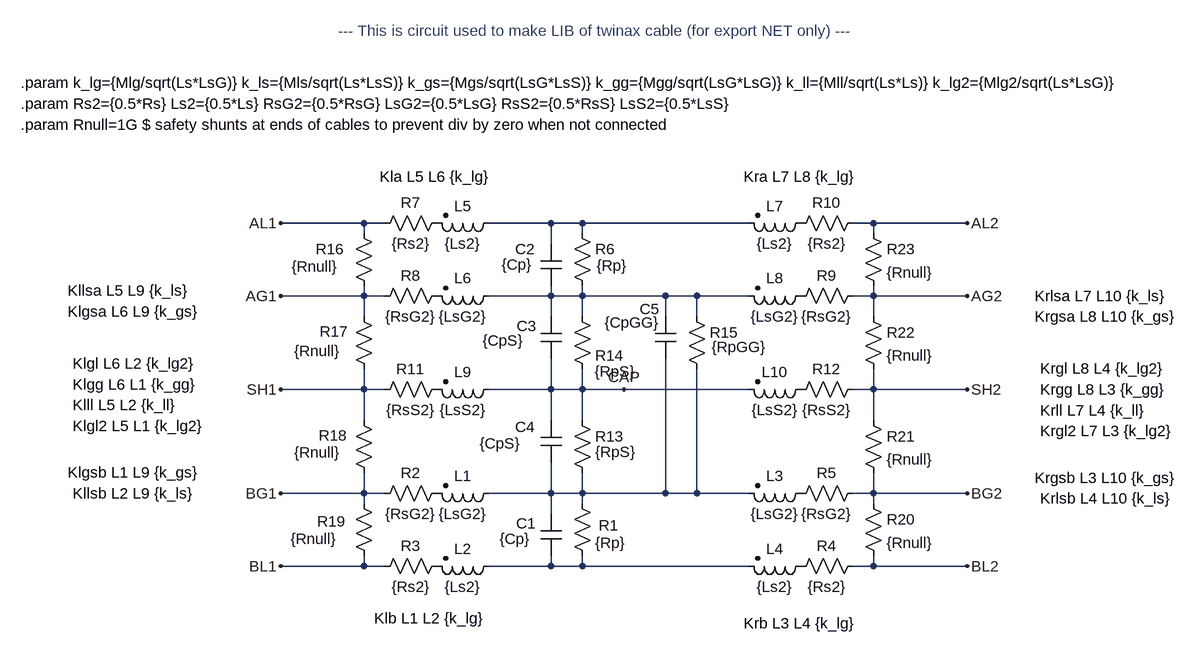
[diagram p0: schematic twax_model_temp.asc]
twax_model_temp.asc, the LTspice schematic file:
Version 4
SHEET 1 1768 680
WIRE -144 -336 -272 -336
WIRE -112 -336 -144 -336
WIRE 144 -336 48 -336
WIRE 192 -336 144 -336
WIRE 448 -336 192 -336
WIRE 640 -336 608 -336
WIRE 784 -336 640 -336
WIRE -144 -320 -144 -336
WIRE 192 -320 192 -336
WIRE 640 -320 640 -336
WIRE 144 -304 144 -336
WIRE -144 -224 -144 -240
WIRE -144 -224 -272 -224
WIRE -112 -224 -144 -224
WIRE 144 -224 144 -240
WIRE 144 -224 48 -224
WIRE 192 -224 192 -240
WIRE 192 -224 144 -224
WIRE 320 -224 192 -224
WIRE 368 -224 320 -224
WIRE 448 -224 368 -224
WIRE 640 -224 640 -240
WIRE 640 -224 608 -224
WIRE 784 -224 640 -224
WIRE -144 -192 -144 -224
WIRE 144 -192 144 -224
WIRE 192 -192 192 -224
WIRE 320 -192 320 -224
WIRE 368 -192 368 -224
WIRE 640 -192 640 -224
WIRE -144 -80 -144 -112
WIRE -144 -80 -272 -80
WIRE -112 -80 -144 -80
WIRE 144 -80 144 -128
WIRE 144 -80 48 -80
WIRE 192 -80 192 -112
WIRE 192 -80 144 -80
WIRE 256 -80 192 -80
WIRE 448 -80 256 -80
WIRE 640 -80 640 -112
WIRE 640 -80 608 -80
WIRE 784 -80 640 -80
WIRE -144 -32 -144 -80
WIRE 144 -32 144 -80
WIRE 192 -32 192 -80
WIRE 640 -32 640 -80
WIRE -144 80 -144 48
WIRE -144 80 -272 80
WIRE -112 80 -144 80
WIRE 144 80 144 32
WIRE 144 80 48 80
WIRE 192 80 192 48
WIRE 192 80 144 80
WIRE 320 80 320 -128
WIRE 320 80 192 80
WIRE 368 80 368 -112
WIRE 368 80 320 80
WIRE 448 80 368 80
WIRE 640 80 640 48
WIRE 640 80 608 80
WIRE 784 80 640 80
WIRE -144 96 -144 80
WIRE 192 96 192 80
WIRE 640 96 640 80
WIRE 144 112 144 80
WIRE -144 192 -144 176
WIRE -144 192 -272 192
WIRE -112 192 -144 192
WIRE 144 192 144 176
WIRE 144 192 48 192
WIRE 192 192 192 176
WIRE 192 192 144 192
WIRE 448 192 192 192
WIRE 640 192 640 176
WIRE 640 192 608 192
WIRE 784 192 640 192
FLAG -272 -336 AL1
FLAG -272 -224 AG1
FLAG 784 -336 AL2
FLAG 784 -224 AG2
FLAG 784 80 BG2
FLAG 784 192 BL2
FLAG -272 80 BG1
FLAG -272 192 BL1
FLAG -272 -80 SH1
FLAG 784 -80 SH2
FLAG 256 -80 CAP
SYMBOL ind2 64 64 R90
WINDOW 0 5 56 VBottom 2
WINDOW 3 32 56 VTop 2
SYMATTR InstName L1
SYMATTR Value {LsG2}
SYMATTR Type ind
SYMBOL ind2 64 176 R90
WINDOW 0 5 56 VBottom 2
WINDOW 3 32 56 VTop 2
SYMATTR InstName L2
SYMATTR Value {Ls2}
SYMATTR Type ind
SYMBOL ind2 544 64 R90
WINDOW 0 5 56 VBottom 2
WINDOW 3 32 56 VTop 2
SYMATTR InstName L3
SYMATTR Value {LsG2}
SYMATTR Type ind
SYMBOL ind2 544 176 R90
WINDOW 0 5 56 VBottom 2
WINDOW 3 32 56 VTop 2
SYMATTR InstName L4
SYMATTR Value {Ls2}
SYMATTR Type ind
SYMBOL cap 128 112 R0
WINDOW 0 -38 14 Left 2
WINDOW 3 -63 38 Left 2
SYMATTR InstName C1
SYMATTR Value {Cp}
SYMBOL res 176 80 R0
WINDOW 0 41 49 Left 2
SYMATTR InstName R1
SYMATTR Value {Rp}
SYMBOL res -16 64 R90
WINDOW 0 0 56 VBottom 2
WINDOW 3 32 56 VTop 2
SYMATTR InstName R2
SYMATTR Value {RsG2}
SYMBOL res -16 176 R90
WINDOW 0 0 56 VBottom 2
WINDOW 3 32 56 VTop 2
SYMATTR InstName R3
SYMATTR Value {Rs2}
SYMBOL res 624 176 R90
WINDOW 0 0 56 VBottom 2
WINDOW 3 32 56 VTop 2
SYMATTR InstName R4
SYMATTR Value {Rs2}
SYMBOL res 624 64 R90
WINDOW 0 0 56 VBottom 2
WINDOW 3 32 56 VTop 2
SYMATTR InstName R5
SYMATTR Value {RsG2}
SYMBOL ind2 64 -352 R90
WINDOW 0 5 56 VBottom 2
WINDOW 3 32 56 VTop 2
SYMATTR InstName L5
SYMATTR Value {Ls2}
SYMATTR Type ind
SYMBOL ind2 64 -240 R90
WINDOW 0 4 56 VBottom 2
WINDOW 3 32 56 VTop 2
SYMATTR InstName L6
SYMATTR Value {LsG2}
SYMATTR Type ind
SYMBOL ind2 544 -352 R90
WINDOW 0 5 56 VBottom 2
WINDOW 3 32 56 VTop 2
SYMATTR InstName L7
SYMATTR Value {Ls2}
SYMATTR Type ind
SYMBOL ind2 544 -240 R90
WINDOW 0 4 56 VBottom 2
WINDOW 3 32 56 VTop 2
SYMATTR InstName L8
SYMATTR Value {LsG2}
SYMATTR Type ind
SYMBOL cap 128 -304 R0
WINDOW 0 -39 8 Left 2
WINDOW 3 -60 32 Left 2
SYMATTR InstName C2
SYMATTR Value {Cp}
SYMBOL res 176 -336 R0
WINDOW 3 38 65 Left 2
SYMATTR Value {Rp}
SYMATTR InstName R6
SYMBOL res -16 -352 R90
WINDOW 0 0 56 VBottom 2
WINDOW 3 32 56 VTop 2
SYMATTR InstName R7
SYMATTR Value {Rs2}
SYMBOL res -16 -240 R90
WINDOW 0 0 56 VBottom 2
WINDOW 3 32 56 VTop 2
SYMATTR InstName R8
SYMATTR Value {RsG2}
SYMBOL res 624 -240 R90
WINDOW 0 0 56 VBottom 2
WINDOW 3 32 56 VTop 2
SYMATTR InstName R9
SYMATTR Value {RsG2}
SYMBOL res 624 -352 R90
WINDOW 0 0 56 VBottom 2
WINDOW 3 32 56 VTop 2
SYMATTR InstName R10
SYMATTR Value {Rs2}
SYMBOL ind2 64 -96 R90
WINDOW 0 5 56 VBottom 2
WINDOW 3 32 56 VTop 2
SYMATTR InstName L9
SYMATTR Value {LsS2}
SYMATTR Type ind
SYMBOL ind2 544 -96 R90
WINDOW 0 5 56 VBottom 2
WINDOW 3 32 56 VTop 2
SYMATTR InstName L10
SYMATTR Value {LsS2}
SYMATTR Type ind
SYMBOL res -16 -96 R90
WINDOW 0 0 56 VBottom 2
WINDOW 3 32 56 VTop 2
SYMATTR InstName R11
SYMATTR Value {RsS2}
SYMBOL res 624 -96 R90
WINDOW 0 0 56 VBottom 2
WINDOW 3 32 56 VTop 2
SYMATTR InstName R12
SYMATTR Value {RsS2}
SYMBOL cap 128 -192 R0
WINDOW 0 -37 14 Left 2
WINDOW 3 -89 37 Left 2
SYMATTR InstName C3
SYMATTR Value {CpS}
SYMBOL cap 128 -32 R0
WINDOW 0 -39 10 Left 2
WINDOW 3 -94 35 Left 2
SYMATTR InstName C4
SYMATTR Value {CpS}
SYMBOL res 176 -48 R0
WINDOW 3 36 64 Left 2
SYMATTR Value {RpS}
SYMATTR InstName R13
SYMBOL res 176 -208 R0
WINDOW 0 36 76 Left 2
WINDOW 3 35 100 Left 2
SYMATTR InstName R14
SYMATTR Value {RpS}
SYMBOL cap 304 -192 R0
WINDOW 0 -24 -12 Left 2
WINDOW 3 -78 9 Left 2
SYMATTR InstName C5
SYMATTR Value {CpGG}
SYMBOL res 352 -208 R0
WINDOW 3 39 63 Left 2
SYMATTR Value {RpGG}
SYMATTR InstName R15
SYMBOL res -160 -336 R0
WINDOW 0 -58 40 Left 2
WINDOW 3 -95 67 Left 2
SYMATTR InstName R16
SYMATTR Value {Rnull}
SYMBOL res -160 -208 R0
WINDOW 0 -52 39 Left 2
WINDOW 3 -91 69 Left 2
SYMATTR InstName R17
SYMATTR Value {Rnull}
SYMBOL res -160 -48 R0
WINDOW 0 -54 39 Left 2
WINDOW 3 -91 65 Left 2
SYMATTR InstName R18
SYMATTR Value {Rnull}
SYMBOL res -160 80 R0
WINDOW 0 -56 43 Left 2
WINDOW 3 -97 70 Left 2
SYMATTR InstName R19
SYMATTR Value {Rnull}
SYMBOL res 624 80 R0
SYMATTR InstName R20
SYMATTR Value {Rnull}
SYMBOL res 624 -48 R0
SYMATTR InstName R21
SYMATTR Value {Rnull}
SYMBOL res 624 -208 R0
SYMATTR InstName R22
SYMATTR Value {Rnull}
SYMBOL res 624 -336 R0
SYMATTR InstName R23
SYMATTR Value {Rnull}
TEXT -184 -632 Left 2 ;--- This is circuit used to make LIB of twinax cable (for export NET only) ---
TEXT -672 -488 Left 2 !.param Rnull=1G $ safety shunts at ends of cables to prevent div by zero when not connected
TEXT -672 -552 Left 2 !.param k_lg={Mlg/sqrt(Ls*LsG)} k_ls={Mls/sqrt(Ls*LsS)} k_gs={Mgs/sqrt(LsG*LsS)} k_gg={Mgg/sqrt(LsG*LsG)} k_ll={Mll/sqrt(Ls*Ls)} k_lg2={Mlg2/sqrt(Ls*LsG)}
TEXT -672 -520 Left 2 !.param Rs2={0.5*Rs} Ls2={0.5*Ls} RsG2={0.5*RsG} LsG2={0.5*LsG} RsS2={0.5*RsS} LsS2={0.5*LsS}
TEXT -120 -408 Left 2 !Kla L5 L6 {k_lg}
TEXT 440 -408 Left 2 !Kra L7 L8 {k_lg}
TEXT -128 272 Left 2 !Klb L1 L2 {k_lg}
TEXT 440 280 Left 2 !Krb L3 L4 {k_lg}
TEXT -600 -232 Left 2 !Kllsa L5 L9 {k_ls}
TEXT -600 -200 Left 2 !Klgsa L6 L9 {k_gs}
TEXT -600 48 Left 2 !Klgsb L1 L9 {k_gs}
TEXT -592 80 Left 2 !Kllsb L2 L9 {k_ls}
TEXT -592 -88 Left 2 !Klgg L6 L1 {k_gg}
TEXT -592 -56 Left 2 !Klll L5 L2 {k_ll}
TEXT -592 -120 Left 2 !Klgl L6 L2 {k_lg2}
TEXT -592 -24 Left 2 !Klgl2 L5 L1 {k_lg2}
TEXT 888 -224 Left 2 !Krlsa L7 L10 {k_ls}
TEXT 888 -192 Left 2 !Krgsa L8 L10 {k_gs}
TEXT 888 56 Left 2 !Krgsb L3 L10 {k_gs}
TEXT 896 88 Left 2 !Krlsb L4 L10 {k_ls}
TEXT 896 -80 Left 2 !Krgg L8 L3 {k_gg}
TEXT 896 -48 Left 2 !Krll L7 L4 {k_ll}
TEXT 896 -112 Left 2 !Krgl L8 L4 {k_lg2}
TEXT 896 -16 Left 2 !Krgl2 L7 L3 {k_lg2}

The netlist it stands for:
* twax_model_temp.asc
L1 N003 P001 {LsG2}
L2 N004 P002 {Ls2}
L3 P003 N003 {LsG2}
L4 P004 N004 {Ls2}
C1 N003 N004 {Cp}
R1 N003 N004 {Rp}
R2 P001 BG1 {RsG2}
R3 P002 BL1 {Rs2}
R4 BL2 P004 {Rs2}
R5 BG2 P003 {RsG2}
L5 N001 P005 {Ls2}
L6 N002 P006 {LsG2}
L7 P007 N001 {Ls2}
L8 P008 N002 {LsG2}
C2 N001 N002 {Cp}
R6 N001 N002 {Rp}
R7 P005 AL1 {Rs2}
R8 P006 AG1 {RsG2}
R9 AG2 P008 {RsG2}
R10 AL2 P007 {Rs2}
L9 CAP P009 {LsS2}
L10 P010 CAP {LsS2}
R11 P009 SH1 {RsS2}
R12 SH2 P010 {RsS2}
C3 N002 CAP {CpS}
C4 CAP N003 {CpS}
R13 CAP N003 {RpS}
R14 N002 CAP {RpS}
C5 N002 N003 {CpGG}
R15 N002 N003 {RpGG}
R16 AL1 AG1 {Rnull}
R17 AG1 SH1 {Rnull}
R18 SH1 BG1 {Rnull}
R19 BG1 BL1 {Rnull}
R20 BG2 BL2 {Rnull}
R21 SH2 BG2 {Rnull}
R22 AG2 SH2 {Rnull}
R23 AL2 AG2 {Rnull}
* --- This is circuit used to make LIB of twinax cable (for export NET only) ---
.param Rnull=1G $ safety shunts at ends of cables to prevent div by zero when not connected
.param k_lg={Mlg/sqrt(Ls*LsG)} k_ls={Mls/sqrt(Ls*LsS)} k_gs={Mgs/sqrt(LsG*LsS)} k_gg={Mgg/sqrt(LsG*LsG)} k_ll={Mll/sqrt(Ls*Ls)} k_lg2={Mlg2/sqrt(Ls*LsG)}
.param Rs2={0.5*Rs} Ls2={0.5*Ls} RsG2={0.5*RsG} LsG2={0.5*LsG} RsS2={0.5*RsS} LsS2={0.5*LsS}
Kla L5 L6 {k_lg}
Kra L7 L8 {k_lg}
Klb L1 L2 {k_lg}
Krb L3 L4 {k_lg}
Kllsa L5 L9 {k_ls}
Klgsa L6 L9 {k_gs}
Klgsb L1 L9 {k_gs}
Kllsb L2 L9 {k_ls}
Klgg L6 L1 {k_gg}
Klll L5 L2 {k_ll}
Klgl L6 L2 {k_lg2}
Klgl2 L5 L1 {k_lg2}
Krlsa L7 L10 {k_ls}
Krgsa L8 L10 {k_gs}
Krgsb L3 L10 {k_gs}
Krlsb L4 L10 {k_ls}
Krgg L8 L3 {k_gg}
Krll L7 L4 {k_ll}
Krgl L8 L4 {k_lg2}
Krgl2 L7 L3 {k_lg2}
.backanno
.end